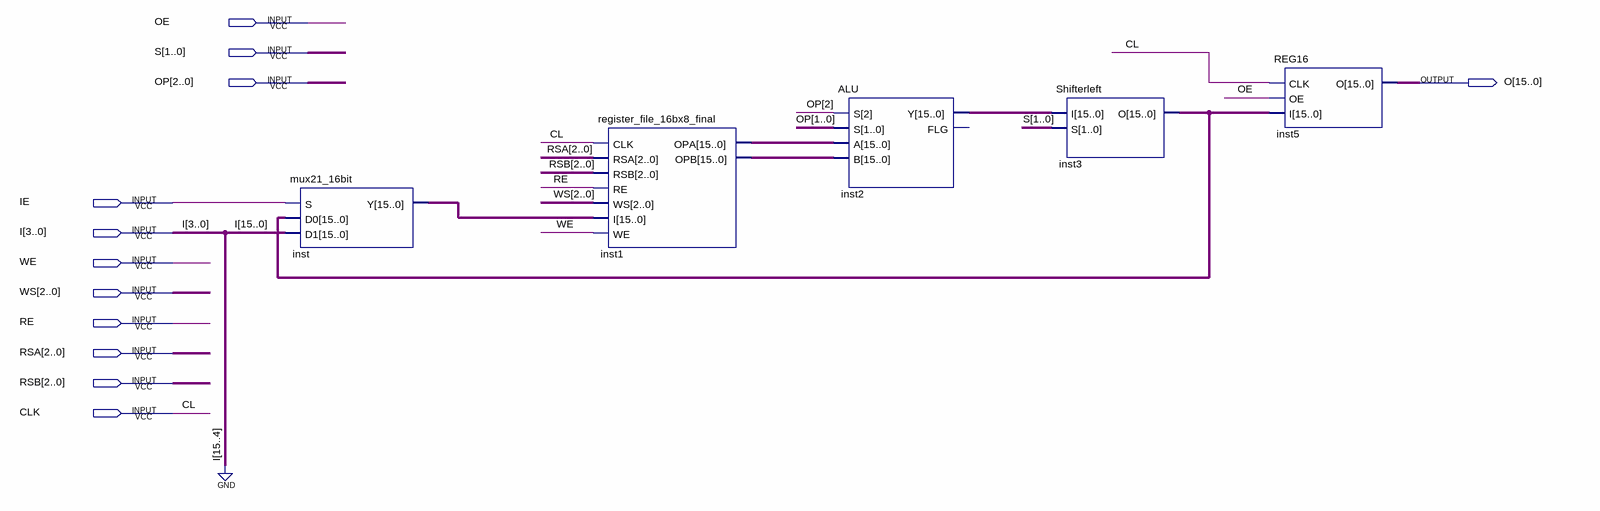
[diagram p0: schematic sheet]
// Quartus schematic Datapath.bdf as structural Verilog: 5 symbols, 12 pins
module Datapath (
  input  OE,
  input  [1:0] S,
  input  [2:0] OP,
  input  IE,
  input  [3:0] I,
  input  WE,
  input  [2:0] WS,
  input  RE,
  input  [2:0] RSA,
  input  [2:0] RSB,
  input  CLK,
  output [15:0] O
);

  wire [15:0] inst1_opa, inst1_opb, inst2_y, inst3_o, inst_y;

  mux21_16bit inst (.S(IE), .D0(inst3_o), .D1({{12{1'b0}}, I}), .Y(inst_y));
  register_file_16bx8_final inst1 (
    .CLK(CLK), .RSA(RSA), .RSB(RSB), .RE(RE), .WS(WS), .I(inst_y), .WE(WE), .OPA(inst1_opa), .OPB(inst1_opb));
  ALU inst2 (.S(OP), .A(inst1_opa), .B(inst1_opb), .Y(inst2_y));  // open: FLG
  Shifterleft inst3 (.I(inst2_y), .S(S), .O(inst3_o));
  REG16 inst5 (.CLK(CLK), .OE(OE), .I(inst3_o), .O(O));

  // Other names for the same wires on the sheet: CL = CLK
endmodule
